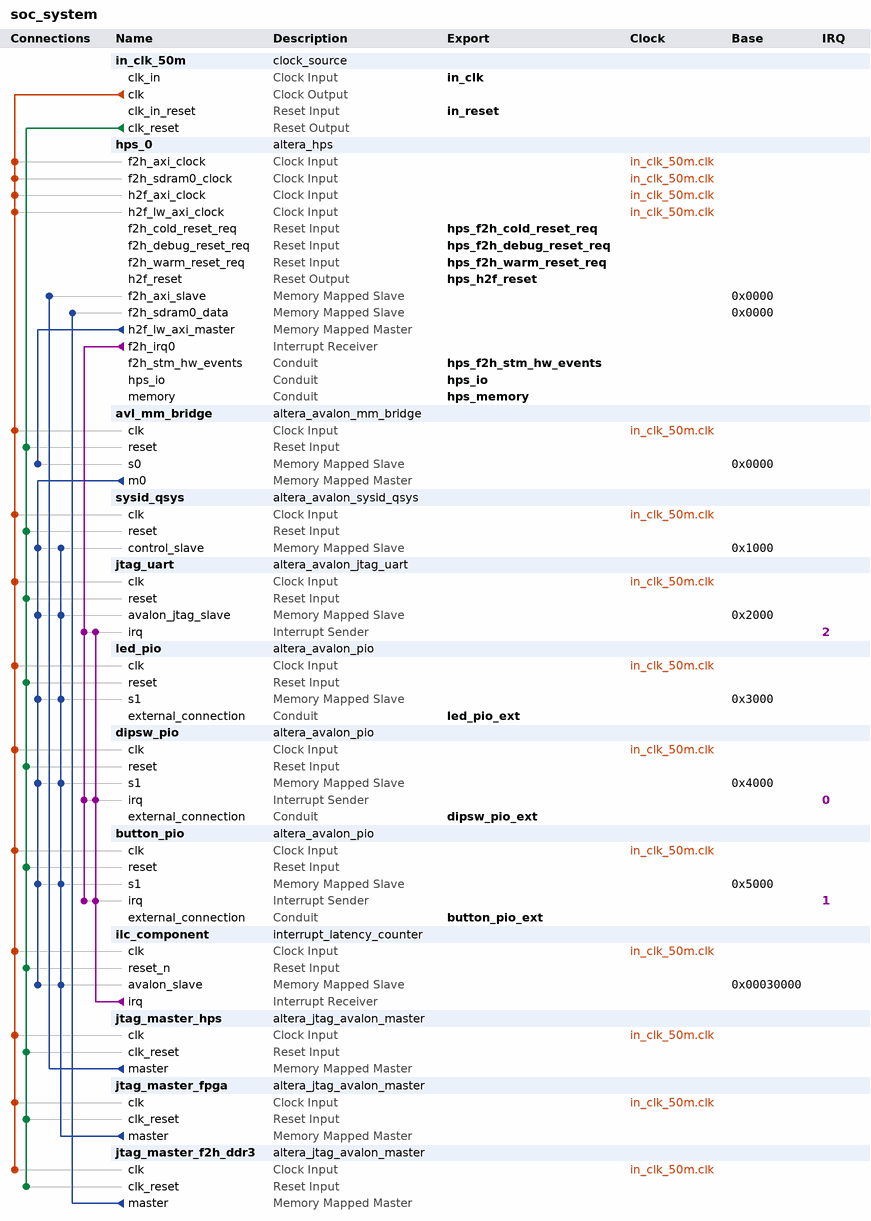
[diagram p0: system contents]
# Platform Designer (Qsys) system soc_system, Cyclone V 5CSEMA6U23I7
# Parameters at their usual value, and those the tool derives, are not listed.
package require -exact qsys 25.1
create_system soc_system
set_project_property DEVICE_FAMILY {Cyclone V}
set_project_property DEVICE 5CSEMA6U23I7

add_instance in_clk_50m clock_source 25.1
set_instance_parameter_value in_clk_50m clockFrequency 50000000

add_instance hps_0 altera_hps 25.1
set_instance_parameter_value hps_0 EMAC1_Mode RGMII
set_instance_parameter_value hps_0 EMAC1_PinMuxing {HPS I/O Set 0}
set_instance_parameter_value hps_0 F2SCLK_COLDRST_Enable true
set_instance_parameter_value hps_0 F2SCLK_DBGRST_Enable true
set_instance_parameter_value hps_0 F2SCLK_WARMRST_Enable true
set_instance_parameter_value hps_0 F2SDRAM_Type {Avalon-MM Bidirectional}
set_instance_parameter_value hps_0 F2SDRAM_Width 256
set_instance_parameter_value hps_0 F2SINTERRUPT_Enable true
set_instance_parameter_value hps_0 F2S_Width 2
set_instance_parameter_value hps_0 FPGA_PERIPHERAL_OUTPUT_CLOCK_FREQ_EMAC0_GTX_CLK 125
set_instance_parameter_value hps_0 FPGA_PERIPHERAL_OUTPUT_CLOCK_FREQ_EMAC0_MD_CLK 2.5
set_instance_parameter_value hps_0 FPGA_PERIPHERAL_OUTPUT_CLOCK_FREQ_EMAC1_GTX_CLK 125
set_instance_parameter_value hps_0 FPGA_PERIPHERAL_OUTPUT_CLOCK_FREQ_EMAC1_MD_CLK 2.5
set_instance_parameter_value hps_0 HPS_PROTOCOL DDR3
set_instance_parameter_value hps_0 I2C0_Mode I2C
set_instance_parameter_value hps_0 I2C0_PinMuxing {HPS I/O Set 0}
set_instance_parameter_value hps_0 I2C1_Mode I2C
set_instance_parameter_value hps_0 I2C1_PinMuxing {HPS I/O Set 0}
set_instance_parameter_value hps_0 LWH2F_Enable true
set_instance_parameter_value hps_0 MEM_BANKADDR_WIDTH 3
set_instance_parameter_value hps_0 MEM_CLK_FREQ 400.0
set_instance_parameter_value hps_0 MEM_COL_ADDR_WIDTH 10
set_instance_parameter_value hps_0 MEM_DQ_WIDTH 32
set_instance_parameter_value hps_0 MEM_DRV_STR RZQ/6
set_instance_parameter_value hps_0 MEM_ROW_ADDR_WIDTH 15
set_instance_parameter_value hps_0 MEM_RTT_NOM RZQ/6
set_instance_parameter_value hps_0 MEM_RTT_WR {Dynamic ODT off}
set_instance_parameter_value hps_0 MEM_TCL 7
set_instance_parameter_value hps_0 MEM_TFAW_NS 37.5
set_instance_parameter_value hps_0 MEM_TRAS_NS 35.0
set_instance_parameter_value hps_0 MEM_TRCD_NS 13.75
set_instance_parameter_value hps_0 MEM_TRFC_NS 300.0
set_instance_parameter_value hps_0 MEM_TRP_NS 13.75
set_instance_parameter_value hps_0 MEM_VENDOR Micron
set_instance_parameter_value hps_0 MEM_WTCL 7
set_instance_parameter_value hps_0 QSPI_Mode N/A
set_instance_parameter_value hps_0 QSPI_PinMuxing Unused
set_instance_parameter_value hps_0 REF_CLK_FREQ 25.0
set_instance_parameter_value hps_0 S2FCLK_USER2CLK 5
set_instance_parameter_value hps_0 S2F_Width 2
set_instance_parameter_value hps_0 SDIO_Mode {4-bit Data}
set_instance_parameter_value hps_0 SDIO_PinMuxing {HPS I/O Set 0}
set_instance_parameter_value hps_0 SPIM1_Mode {Single Slave Select}
set_instance_parameter_value hps_0 SPIM1_PinMuxing {HPS I/O Set 0}
set_instance_parameter_value hps_0 STM_Enable true
set_instance_parameter_value hps_0 TIMING_BOARD_AC_SKEW 0.02
set_instance_parameter_value hps_0 TIMING_BOARD_AC_TO_CK_SKEW 0.0
set_instance_parameter_value hps_0 TIMING_BOARD_DQ_TO_DQS_SKEW 0.0
set_instance_parameter_value hps_0 TIMING_BOARD_MAX_CK_DELAY 0.6
set_instance_parameter_value hps_0 TIMING_BOARD_MAX_DQS_DELAY 0.6
set_instance_parameter_value hps_0 TIMING_BOARD_SKEW_BETWEEN_DQS 0.02
set_instance_parameter_value hps_0 TIMING_BOARD_SKEW_CKDQS_DIMM_MAX 0.01
set_instance_parameter_value hps_0 TIMING_BOARD_SKEW_CKDQS_DIMM_MIN -0.01
set_instance_parameter_value hps_0 TIMING_BOARD_SKEW_WITHIN_DQS 0.02
set_instance_parameter_value hps_0 TIMING_TDH 125
set_instance_parameter_value hps_0 TIMING_TDQSCK 400
set_instance_parameter_value hps_0 TIMING_TDQSQ 120
set_instance_parameter_value hps_0 TIMING_TDS 50
set_instance_parameter_value hps_0 TIMING_TIH 250
set_instance_parameter_value hps_0 TIMING_TIS 175
set_instance_parameter_value hps_0 TIMING_TQSH 0.38
set_instance_parameter_value hps_0 UART0_Mode {No Flow Control}
set_instance_parameter_value hps_0 UART0_PinMuxing {HPS I/O Set 0}
set_instance_parameter_value hps_0 USB1_Mode SDR
set_instance_parameter_value hps_0 USB1_PinMuxing {HPS I/O Set 0}
set_instance_parameter_value hps_0 desired_cfg_clk_mhz 100.0
set_instance_parameter_value hps_0 desired_qspi_clk_mhz 400.0

add_instance avl_mm_bridge altera_avalon_mm_bridge 25.1
set_instance_parameter_value avl_mm_bridge ADDRESS_UNITS SYMBOLS
set_instance_parameter_value avl_mm_bridge ADDRESS_WIDTH 10
set_instance_parameter_value avl_mm_bridge DATA_WIDTH 32
set_instance_parameter_value avl_mm_bridge MAX_PENDING_RESPONSES 4
set_instance_parameter_value avl_mm_bridge USE_AUTO_ADDRESS_WIDTH 1

add_instance sysid_qsys altera_avalon_sysid_qsys 25.1
set_instance_parameter_value sysid_qsys id -1395322110

add_instance jtag_uart altera_avalon_jtag_uart 25.1
set_instance_parameter_value jtag_uart simInteractiveOptions NO_INTERACTIVE_WINDOWS

add_instance led_pio altera_avalon_pio 25.1
set_instance_parameter_value led_pio bitClearingEdgeCapReg true
set_instance_parameter_value led_pio bitModifyingOutReg true
set_instance_parameter_value led_pio captureEdge true
set_instance_parameter_value led_pio direction Output
set_instance_parameter_value led_pio edgeType FALLING
set_instance_parameter_value led_pio generateIRQ true
set_instance_parameter_value led_pio irqType EDGE
set_instance_parameter_value led_pio width 1

add_instance dipsw_pio altera_avalon_pio 25.1
set_instance_parameter_value dipsw_pio bitClearingEdgeCapReg true
set_instance_parameter_value dipsw_pio captureEdge true
set_instance_parameter_value dipsw_pio direction Input
set_instance_parameter_value dipsw_pio edgeType ANY
set_instance_parameter_value dipsw_pio generateIRQ true
set_instance_parameter_value dipsw_pio irqType EDGE
set_instance_parameter_value dipsw_pio width 4

add_instance button_pio altera_avalon_pio 25.1
set_instance_parameter_value button_pio bitClearingEdgeCapReg true
set_instance_parameter_value button_pio captureEdge true
set_instance_parameter_value button_pio direction Input
set_instance_parameter_value button_pio edgeType FALLING
set_instance_parameter_value button_pio generateIRQ true
set_instance_parameter_value button_pio irqType EDGE
set_instance_parameter_value button_pio width 2

add_instance ilc_component interrupt_latency_counter 25.1

add_instance jtag_master_hps altera_jtag_avalon_master 25.1

add_instance jtag_master_fpga altera_jtag_avalon_master 25.1

add_instance jtag_master_f2h_ddr3 altera_jtag_avalon_master 25.1

# connections
add_connection in_clk_50m.clk avl_mm_bridge.clk clock
add_connection in_clk_50m.clk button_pio.clk clock
add_connection in_clk_50m.clk dipsw_pio.clk clock
add_connection in_clk_50m.clk hps_0.f2h_axi_clock clock
add_connection in_clk_50m.clk hps_0.f2h_sdram0_clock clock
add_connection in_clk_50m.clk hps_0.h2f_axi_clock clock
add_connection in_clk_50m.clk hps_0.h2f_lw_axi_clock clock
add_connection in_clk_50m.clk ilc_component.clk clock
add_connection in_clk_50m.clk jtag_master_f2h_ddr3.clk clock
add_connection in_clk_50m.clk jtag_master_fpga.clk clock
add_connection in_clk_50m.clk jtag_master_hps.clk clock
add_connection in_clk_50m.clk jtag_uart.clk clock
add_connection in_clk_50m.clk led_pio.clk clock
add_connection in_clk_50m.clk sysid_qsys.clk clock
add_connection in_clk_50m.clk_reset avl_mm_bridge.reset reset
add_connection in_clk_50m.clk_reset button_pio.reset reset
add_connection in_clk_50m.clk_reset dipsw_pio.reset reset
add_connection in_clk_50m.clk_reset ilc_component.reset_n reset
add_connection in_clk_50m.clk_reset jtag_master_f2h_ddr3.clk_reset reset
add_connection in_clk_50m.clk_reset jtag_master_fpga.clk_reset reset
add_connection in_clk_50m.clk_reset jtag_master_hps.clk_reset reset
add_connection in_clk_50m.clk_reset jtag_uart.reset reset
add_connection in_clk_50m.clk_reset led_pio.reset reset
add_connection in_clk_50m.clk_reset sysid_qsys.reset reset
add_connection avl_mm_bridge.m0 button_pio.s1 avalon
set_connection_parameter_value avl_mm_bridge.m0/button_pio.s1 baseAddress 0x5000
add_connection avl_mm_bridge.m0 dipsw_pio.s1 avalon
set_connection_parameter_value avl_mm_bridge.m0/dipsw_pio.s1 baseAddress 0x4000
add_connection avl_mm_bridge.m0 ilc_component.avalon_slave avalon
set_connection_parameter_value avl_mm_bridge.m0/ilc_component.avalon_slave baseAddress 0x00030000
add_connection avl_mm_bridge.m0 jtag_uart.avalon_jtag_slave avalon
set_connection_parameter_value avl_mm_bridge.m0/jtag_uart.avalon_jtag_slave baseAddress 0x2000
add_connection avl_mm_bridge.m0 led_pio.s1 avalon
set_connection_parameter_value avl_mm_bridge.m0/led_pio.s1 baseAddress 0x3000
add_connection avl_mm_bridge.m0 sysid_qsys.control_slave avalon
set_connection_parameter_value avl_mm_bridge.m0/sysid_qsys.control_slave baseAddress 0x1000
add_connection hps_0.h2f_lw_axi_master avl_mm_bridge.s0 avalon
set_connection_parameter_value hps_0.h2f_lw_axi_master/avl_mm_bridge.s0 baseAddress 0x0000
add_connection jtag_master_f2h_ddr3.master hps_0.f2h_sdram0_data avalon
set_connection_parameter_value jtag_master_f2h_ddr3.master/hps_0.f2h_sdram0_data baseAddress 0x0000
add_connection jtag_master_fpga.master button_pio.s1 avalon
set_connection_parameter_value jtag_master_fpga.master/button_pio.s1 baseAddress 0x5000
add_connection jtag_master_fpga.master dipsw_pio.s1 avalon
set_connection_parameter_value jtag_master_fpga.master/dipsw_pio.s1 baseAddress 0x4000
add_connection jtag_master_fpga.master ilc_component.avalon_slave avalon
set_connection_parameter_value jtag_master_fpga.master/ilc_component.avalon_slave baseAddress 0x00030000
add_connection jtag_master_fpga.master jtag_uart.avalon_jtag_slave avalon
set_connection_parameter_value jtag_master_fpga.master/jtag_uart.avalon_jtag_slave baseAddress 0x2000
add_connection jtag_master_fpga.master led_pio.s1 avalon
set_connection_parameter_value jtag_master_fpga.master/led_pio.s1 baseAddress 0x3000
add_connection jtag_master_fpga.master sysid_qsys.control_slave avalon
set_connection_parameter_value jtag_master_fpga.master/sysid_qsys.control_slave baseAddress 0x1000
add_connection jtag_master_hps.master hps_0.f2h_axi_slave avalon
set_connection_parameter_value jtag_master_hps.master/hps_0.f2h_axi_slave baseAddress 0x0000
add_connection hps_0.f2h_irq0 button_pio.irq interrupt
set_connection_parameter_value hps_0.f2h_irq0/button_pio.irq irqNumber 1
add_connection hps_0.f2h_irq0 dipsw_pio.irq interrupt
set_connection_parameter_value hps_0.f2h_irq0/dipsw_pio.irq irqNumber 0
add_connection hps_0.f2h_irq0 jtag_uart.irq interrupt
set_connection_parameter_value hps_0.f2h_irq0/jtag_uart.irq irqNumber 2
add_connection ilc_component.irq button_pio.irq interrupt
set_connection_parameter_value ilc_component.irq/button_pio.irq irqNumber 1
add_connection ilc_component.irq dipsw_pio.irq interrupt
set_connection_parameter_value ilc_component.irq/dipsw_pio.irq irqNumber 0
add_connection ilc_component.irq jtag_uart.irq interrupt
set_connection_parameter_value ilc_component.irq/jtag_uart.irq irqNumber 2

# exported interfaces
add_interface button_pio_ext conduit end
set_interface_property button_pio_ext EXPORT_OF button_pio.external_connection
add_interface dipsw_pio_ext conduit end
set_interface_property dipsw_pio_ext EXPORT_OF dipsw_pio.external_connection
add_interface hps_f2h_cold_reset_req reset sink
set_interface_property hps_f2h_cold_reset_req EXPORT_OF hps_0.f2h_cold_reset_req
add_interface hps_f2h_debug_reset_req reset sink
set_interface_property hps_f2h_debug_reset_req EXPORT_OF hps_0.f2h_debug_reset_req
add_interface hps_f2h_stm_hw_events conduit end
set_interface_property hps_f2h_stm_hw_events EXPORT_OF hps_0.f2h_stm_hw_events
add_interface hps_f2h_warm_reset_req reset sink
set_interface_property hps_f2h_warm_reset_req EXPORT_OF hps_0.f2h_warm_reset_req
add_interface hps_h2f_reset reset source
set_interface_property hps_h2f_reset EXPORT_OF hps_0.h2f_reset
add_interface hps_io conduit end
set_interface_property hps_io EXPORT_OF hps_0.hps_io
add_interface hps_memory conduit end
set_interface_property hps_memory EXPORT_OF hps_0.memory
add_interface in_clk clock sink
set_interface_property in_clk EXPORT_OF in_clk_50m.clk_in
add_interface in_reset reset sink
set_interface_property in_reset EXPORT_OF in_clk_50m.clk_in_reset
add_interface led_pio_ext conduit end
set_interface_property led_pio_ext EXPORT_OF led_pio.external_connection

set_interconnect_requirement {$system} qsys_mm.clockCrossingAdapter HANDSHAKE
set_interconnect_requirement {$system} qsys_mm.enableEccProtection FALSE
set_interconnect_requirement {$system} qsys_mm.insertDefaultSlave FALSE
set_interconnect_requirement {$system} qsys_mm.maxAdditionalLatency 1

save_system soc_system.qsys
